# EAGLE design FetherV2_REV1 (EAGLE 9.6.2)
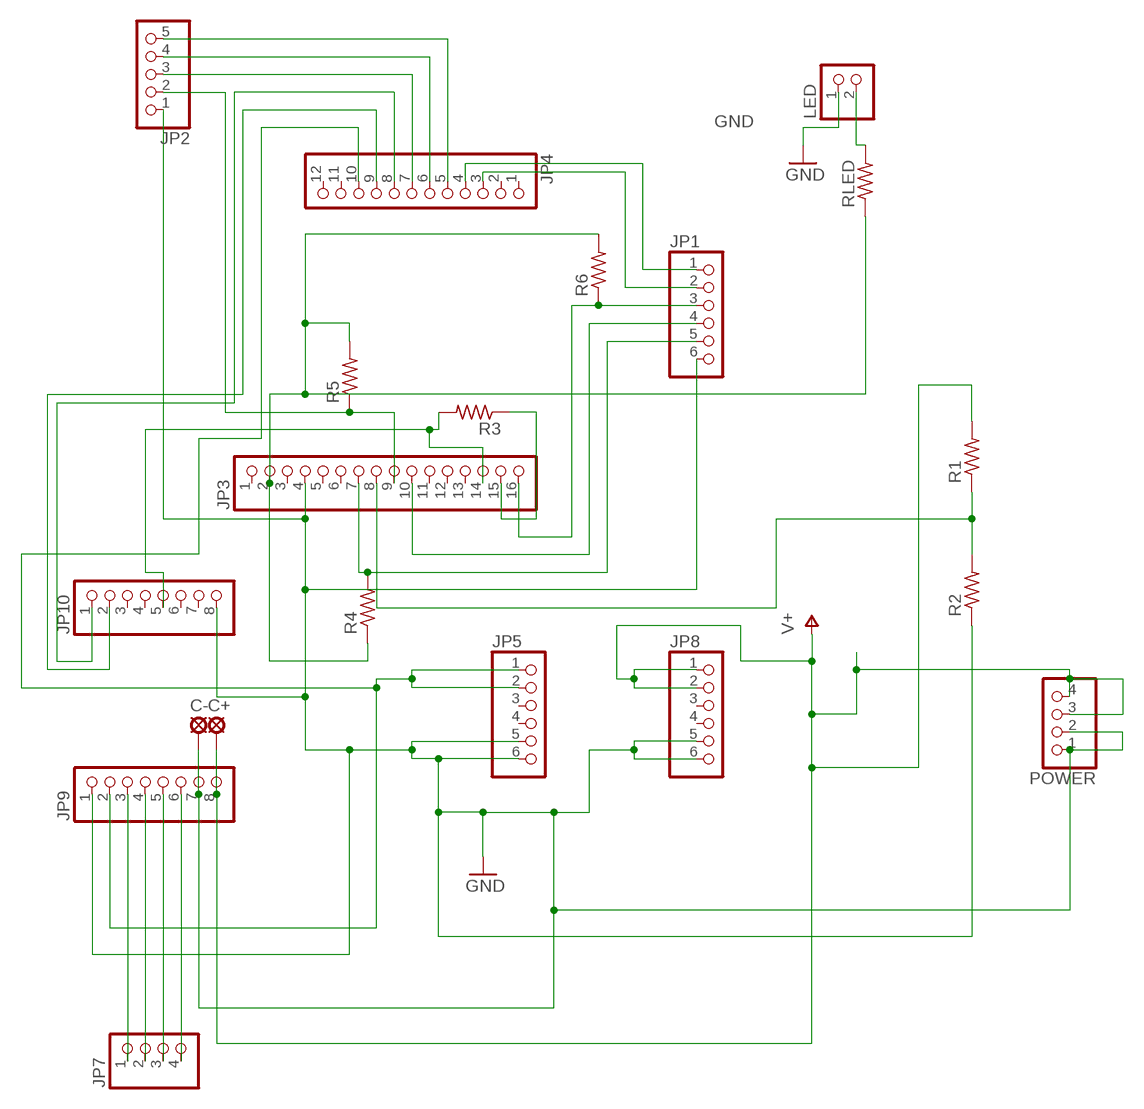
[diagram p0: schematic, sheet 1]

## Parts
C+  SE14  [SE14]
C-  SE14  [SE14]
JP1  PINHD-1X6/90  [1X06/90]
JP2  PINHD-1X5/90  [1X05/90]
JP3  PINHD-1X16  [1X16]
JP4  PINHD-1X12  [1X12]
JP5  PINHD-1X6  [1X06]
JP7  PINHD-1X4  [1X04]
JP8  PINHD-1X6  [1X06]
JP9  PINHD-1X8  [1X08]
JP10  PINHD-1X8  [1X08]
LED  PINHD-1X2  [1X02]
POWER  PINHD-1X4  [1X04]
R1  FLIPFLOP-RES  [0805-THM]
R2  FLIPFLOP-RES  [0805-THM]
R3  FLIPFLOP-RES  [0805-THM]
R4  FLIPFLOP-RES  [0805-THM]
R5  FLIPFLOP-RES  [0805-THM]
R6  FLIPFLOP-RES  [0805-THM]
RLED  FLIPFLOP-RES  [0805-THM]

## Nets
GND: C-.MP JP1.6 JP2.1 JP3.4 JP5.5 JP5.6 JP8.5 JP8.6 JP9.1 JP9.7 JP10.8 LED.1 POWER.1 POWER.2 R2.1
N$1: JP2.2 JP3.9 R5.1
N$2: JP2.3 JP4.7
N$3: JP2.4 JP4.6
N$4: JP2.5 JP4.5
N$5: JP1.1 JP4.4
N$6: JP1.2 JP4.3
N$7: JP7.1 JP9.3
N$8: JP1.3 JP3.16 R6.1
N$9: JP1.4 JP3.10
N$10: JP1.5 JP3.7 R4.2
N$11: LED.2 RLED.2
N$12: JP4.10 JP5.1 JP5.2 JP9.2
N$13: JP7.2 JP9.4
N$14: JP7.3 JP9.5
N$15: JP7.4 JP9.6
N$16: JP3.2 R4.1 R5.2 R6.2 RLED.1
N$17: JP4.8 JP10.1
N$19: JP3.15 R3.1
N$20: JP3.8 R1.1 R2.2
N$21: JP3.14 JP10.5 R3.2
N$22: JP4.9 JP10.2
V+: C+.MP JP8.1 JP8.2 JP9.8 POWER.3 POWER.4 R1.2
Unconnected: JP3.1 JP3.3 JP3.5 JP3.6 JP3.11 JP3.12 JP3.13 JP4.1 JP4.2 JP4.11 JP4.12 JP5.3 JP5.4 JP8.3 JP8.4 JP10.3 JP10.4 JP10.6 JP10.7

## Library data of the parts
C+ C- = solpad:SE14: SOLDER PAD E1553, drill 1,4mm, distributor Buerklin, 07F820
JP1 JP5 JP8 = pinhead:PINHD-1X6: PIN HEADER
JP2 = pinhead:PINHD-1X5: PIN HEADER
JP3 = pinhead:PINHD-1X16: PIN HEADER
JP4 = pinhead:PINHD-1X12: PIN HEADER
JP7 POWER = pinhead:PINHD-1X4: PIN HEADER
JP9 JP10 = pinhead:PINHD-1X8: PIN HEADER
LED = pinhead:PINHD-1X2: PIN HEADER
R1-R6 RLED = adafruit:FLIPFLOP-RES: Flip Flop resistor An 0805 resistor inside a standard 1/4W 5% resistor. Makes for easy mods

## Board
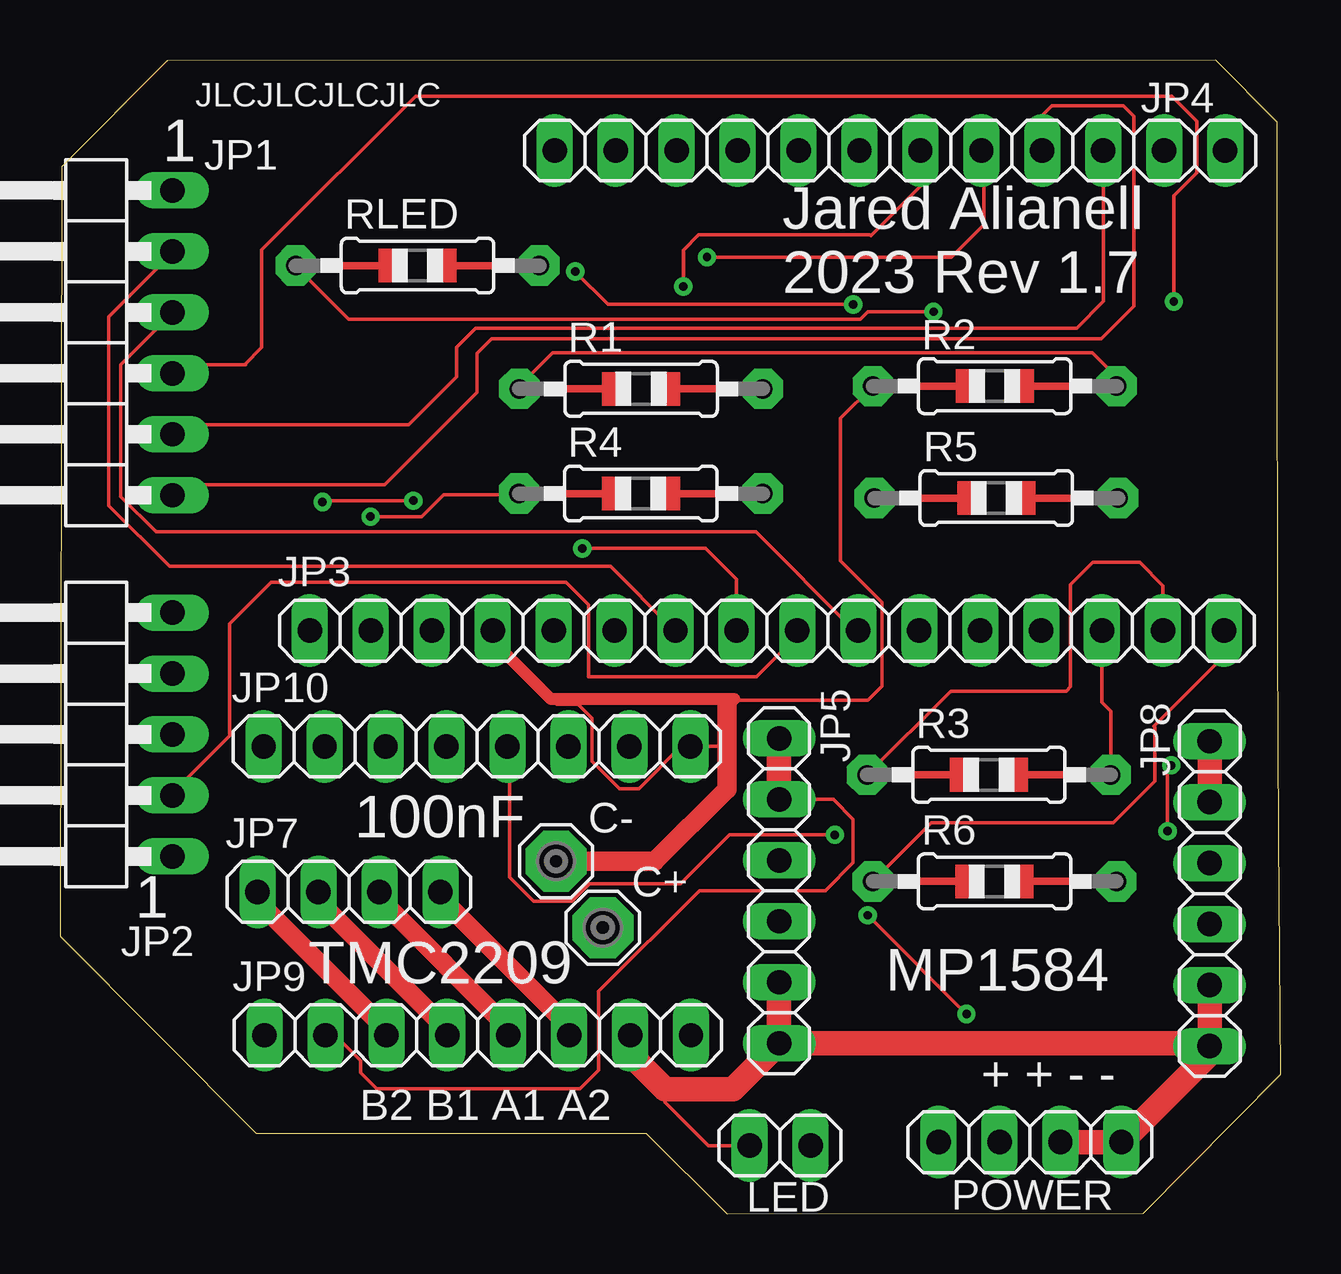
[diagram p1: board, top side]
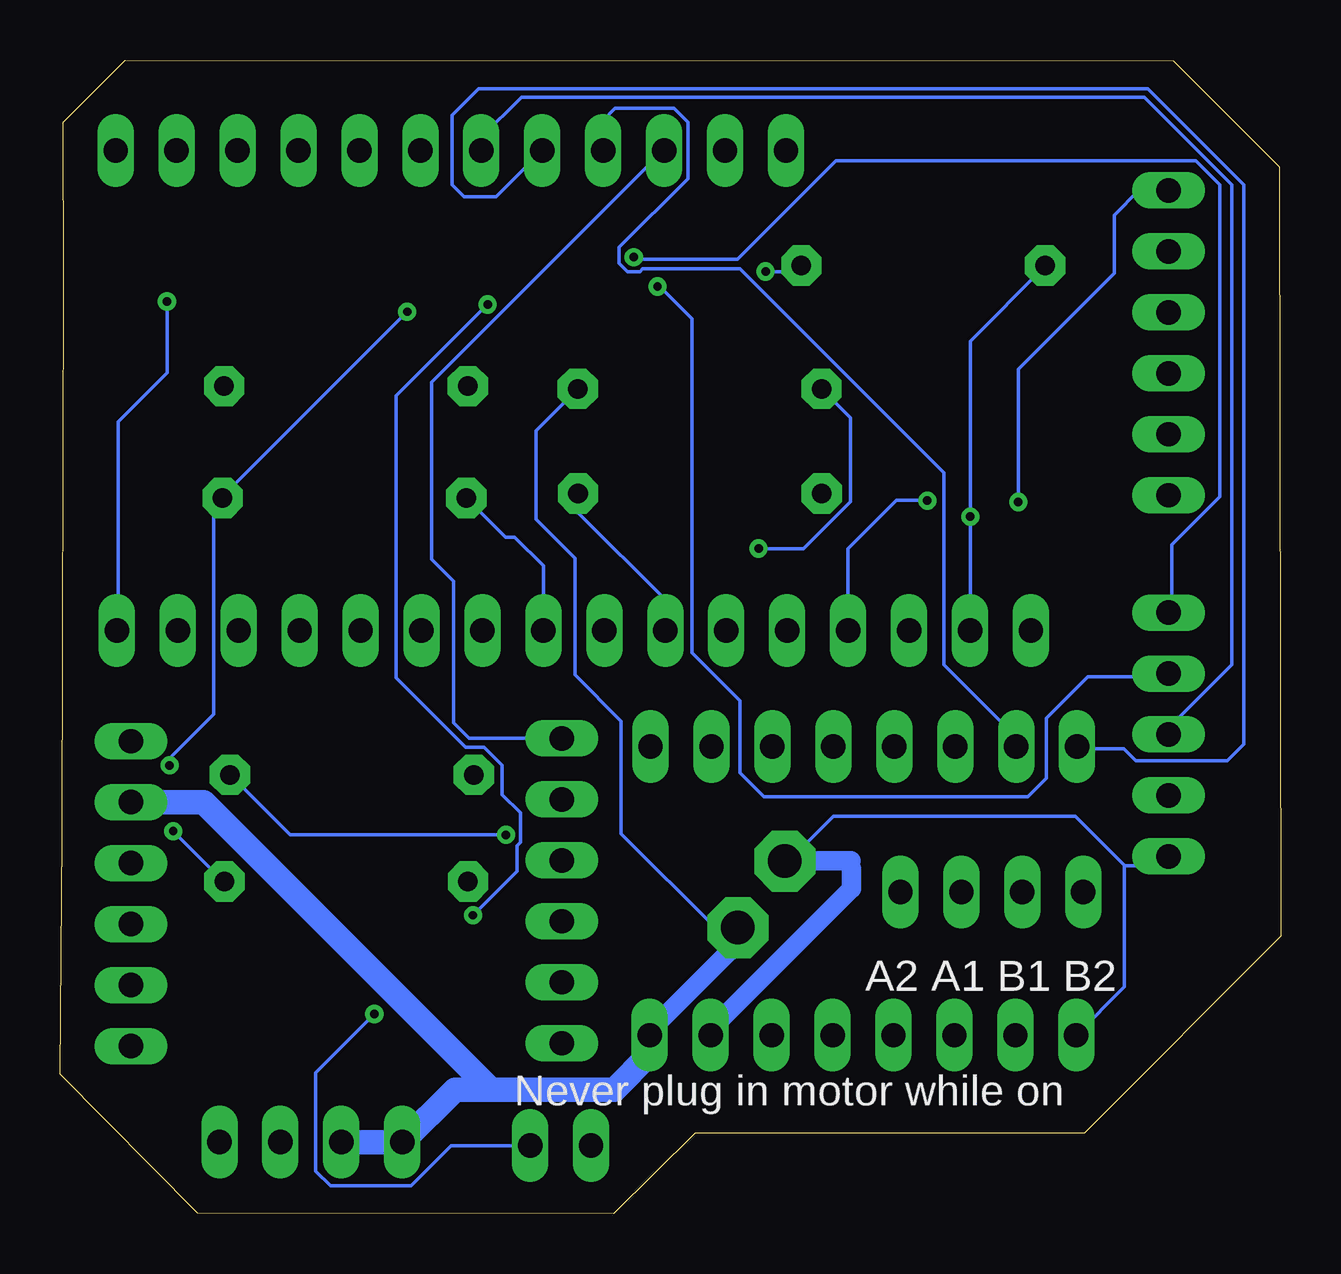
[diagram p2: board, bottom side, seen from below]

Size 50.89 x 48.07 mm. Coordinates in mm from the lower left corner, seen from the top.
Outline: 48.17,48.07 4.47,48.04 0.06,43.62 0,11.56 8.19,3.35 24.43,3.36 27.81,0 45.15,0.01 50.89,5.81 50.8,15.68 50.76,23.8 50.74,38.95 50.75,45.47 48.17,48.07
Copper layers (1*16): Top 0.035mm / dielectric 1.5mm / Bottom 0.035mm
Design rules "default": minimum track width 6mil, minimum drill 0.35mm, track to track 6mil, track to pad 6mil, pad to pad 6mil, via to via 6mil, smd to smd 6mil, copper to edge 40mil, drill to drill 6mil, minimum pad ring 10mil, minimum via ring 8mil, stop-mask expansion 4mil, vias tented up to drill 0mil, thermal gap 10mil

### Footprints (pad centres in the part's own frame; a part is rotated, then mirrored left to right if it is on the bottom)
SE14 = drill 1.397 pad 2.54 octagon: MP 0,0
1X06/90 = drill 1.016 long: 1 -6.35,-3.81; 2 -3.81,-3.81; 3 -1.27,-3.81; 4 1.27,-3.81; 5 3.81,-3.81; 6 6.35,-3.81
1X05/90 = drill 1.016 long: 1 -5.08,-3.81; 2 -2.54,-3.81; 3 0,-3.81; 4 2.54,-3.81; 5 5.08,-3.81
1X16 = drill 1.016 long: 1 -19.05,0; 2 -16.51,0; 3 -13.97,0; 4 -11.43,0; 5 -8.89,0; 6 -6.35,0; 7 -3.81,0; 8 -1.27,0; 9 1.27,0; 10 3.81,0; 11 6.35,0; 12 8.89,0; 13 11.43,0; 14 13.97,0; 15 16.51,0; 16 19.05,0
1X12 = drill 1.016 long: 1 -13.97,0; 2 -11.43,0; 3 -8.89,0; 4 -6.35,0; 5 -3.81,0; 6 -1.27,0; 7 1.27,0; 8 3.81,0; 9 6.35,0; 10 8.89,0; 11 11.43,0; 12 13.97,0
1X06 = drill 1.016 long: 1 -6.35,0; 2 -3.81,0; 3 -1.27,0; 4 1.27,0; 5 3.81,0; 6 6.35,0
1X04 = drill 1.016 long: 1 -3.81,0; 2 -1.27,0; 3 1.27,0; 4 3.81,0
1X08 = drill 1.016 long: 1 -8.89,0; 2 -6.35,0; 3 -3.81,0; 4 -1.27,0; 5 1.27,0; 6 3.81,0; 7 6.35,0; 8 8.89,0
1X02 = drill 1.016 long: 1 -1.27,0; 2 1.27,0
0805-THM = drill 0.813 pad 1.676 octagon: 1 -5.08,0; 2 5.08,0

### Placement (x,y rotation side)
C+  22.63,11.92 0 top
C-  20.68,14.69 0 top
JP1  0.87,36.28 90 top
JP2  0.87,19.97 90 top
JP3  29.47,24.29 0 top
JP4  34.59,44.3 180 top
JP5  29.98,13.45 270 top
JP7  12.04,13.4 0 top
JP8  47.92,13.34 270 top
JP9  17.41,7.44 0 top
JP10  17.38,19.47 0 top
LED  30.02,2.84 0 top
POWER  40.43,2.98 180 top
R1  24.22,34.37 0 top
R2  38.96,34.48 0 top
R3  38.72,18.29 0 top
R4  24.21,30.01 0 top
R5  39.03,29.82 0 top
R6  38.96,13.85 0 top
RLED  14.9,39.51 0 top

### Tracks (layer width: path | path; a pad name or v marks a point on that pad's centre or on a via)
GND  (via drill 0.35)
  Top 0.152: JP3.4 18.04,23.87 20.69,21.22 21.6,21.22 22.18,20.64 22.18,18.85 23.32,17.72 24.14,17.72 25.89,19.47 JP10.8 27.76,19.47 27.79,19.44 | 21.04,14.87 C-.MP | 23.76,7.95 JP9.7 23.76,6.64 | 29.9,9.72 JP5.5 | 47.8,7.1 JP8.6 | JP8.5 | R2.1 32.54,33.13 32.54,32.74 32.54,27.2 34.27,25.47 34.27,21.99 33.67,21.39 28.15,21.39 28.1,21.44 | POWER.2 41.86,2.82 | POWER.1 44.3,3.04 | v14.73,29.71 11.29,29.71 11.24,29.66 v10.94,29.66 | LED.1 27.02,2.84 25.23,4.63 25.23,5.17
  Top 0.508: 18.04,23.87 20.47,21.44 28.1,21.44
  Top 0.813: C-.MP 24.79,14.69 27.79,17.69 27.79,19.44 27.79,21.13
  Top 1.016: JP5.5 JP5.6 | JP8.5 JP8.6 47.92,6.66 44.3,3.04 | 23.76,6.64 25.23,5.17 28.05,5.17 JP5.6 | 47.8,7.1 JP5.6 | POWER.2 POWER.1
  Bottom 0.152: 20.54,14.37 20.63,14.58 | 20.63,14.58 C-.MP | 23.51,7.93 JP9.7 | 17.91,14.7 17.91,14.39 17.9,14.37 | 6.51,14.51 8.56,16.56 18.65,16.56 20.63,14.58 | JP9.1 6.51,9.45 6.51,14.51 | JP1.6 5.91,42.63 6.94,41.61 6.94,39.19 10.94,35.19 v10.94,29.66 | JP3.4 18.04,27.7 16.01,29.73 14.73,29.73 v14.73,29.71 | JP2.1 5.07,14.5 6.5,14.5 6.51,14.51
  Bottom 0.813: 23.51,7.93 17.9,13.54 17.9,14.37 | C-.MP 20.66,14.7 17.91,14.7
N$1
  Top 0.152: JP2.2 5.04,17.87 7.08,19.92 7.08,24.59 8.81,26.32 21.1,26.32 22.04,25.37 22.04,22.37 29.04,22.37 30.54,23.87 JP3.9
  Bottom 0.152: R5.1 32.31,28.18 31.93,28.18 30.74,26.99 JP3.9
N$2
  Bottom 0.152: JP2.3 4.54,20.37 2.04,22.87 2.04,42.87 5.68,46.52 31.65,46.52 33.33,44.84 JP4.7
N$3  (via drill 0.35)
  Top 0.152: v25.98,38.63 25.98,40.15 26.61,40.78 33.76,40.78 33.79,40.74 35.87,42.81 JP4.6
  Bottom 0.152: JP2.4 5.04,22.37 8.04,22.37 9.77,20.65 9.77,18.15 10.54,17.37 21.54,17.37 22.54,18.37 22.54,21.37 24.54,23.37 24.54,37.29 25.87,38.63 v25.98,38.63
N$4  (via drill 0.35)
  Top 0.152: v26.97,39.86 37.15,39.86 38.5,41.21 38.5,44.2 JP4.5
  Bottom 0.152: JP2.5 4.54,25.37 4.54,27.87 2.54,29.87 2.54,42.87 3.54,43.87 18.54,43.87 22.64,39.77 26.89,39.77 v26.97,39.86
N$5
  Top 0.152: JP1.1 5.04,30.37 13.54,30.37 17.39,34.23 17.39,35.85 17.99,36.45 43.41,36.45 44.76,37.81 44.76,45.72 44.32,46.16 41.35,46.16 40.92,45.72 40.92,44.33 JP4.4
N$6
  Top 0.152: JP1.2 5.04,32.87 14.54,32.87 16.53,34.87 16.53,36.1 17.32,36.9 42.38,36.9 43.5,38.01 JP4.3
N$7
  Top 0.152: 13.71,7.55 JP9.3
  Top 0.813: 13.71,7.55 8.24,13.02 JP7.1
N$8  (via drill 0.35)
  Top 0.152: 7.75,35.37 7.7,35.37 | 7.7,35.37 5.04,35.37 JP1.3 | 7.7,35.37 8.42,36.09 8.42,40.16 14.82,46.57 46.35,46.57 47.38,45.53 47.39,45.5 47.39,43.37 46.43,42.41 v46.43,38.01 | R6.1 36.33,16.3 43.91,16.3 45.63,18.02 45.63,20.27 45.6,20.31 48.52,23.22 JP3.16
  Bottom 0.152: v46.43,38.01 | v46.43,38.01 46.43,35.03 48.45,33.01 48.45,24.32 JP3.16
N$9
  Top 0.152: JP1.4 4.54,37.37 2.54,35.37 2.54,29.87 4,28.41 29,28.41 33.04,24.37 JP3.10
N$10
  Top 0.152: JP1.5 4.54,39.87 2.04,37.37 2.04,29.51 4.57,26.97 22.94,26.97 25.54,24.37 JP3.7
  Bottom 0.152: JP3.7 25.66,25.58 29.29,29.21 R4.2
N$11  (via drill 0.35)
  Top 0.152: v33.67,12.43 v37.78,8.32 | v33.06,37.88 22.85,37.88 v21.48,39.26
  Bottom 0.152: v37.78,8.32 40.22,5.88 40.22,1.77 39.61,1.16 36.26,1.16 34.58,2.83 31.38,2.83 LED.2 | v33.67,12.43 31.84,14.26 31.84,15.33 31.69,15.48 31.69,16.7 32.45,17.46 32.45,18.68 33.21,19.44 33.97,19.44 36.87,22.34 36.87,34.07 v33.06,37.88 | v21.48,39.26 20.26,39.26 20.11,39.41 RLED.2
N$12
  Top 0.152: JP9.2 11.54,7.37 12.54,6.37 12.54,5.87 13.21,5.2 21.68,5.2 22.45,5.98 22.45,9.26 26.65,13.46 31.9,13.46 33.06,14.62 33.06,16.44 32.24,17.26 JP5.2
  Top 1.016: JP5.2 JP5.1
  Bottom 0.152: JP5.1 33.84,19.8 34.48,20.45 34.48,26.35 35.41,27.28 35.41,34.64 25.74,44.3 JP4.10
N$13
  Top 0.152: 16.25,7.55 JP9.4
  Top 0.813: 16.25,7.55 10.78,13.02 JP7.2
N$14
  Top 0.152: 18.82,7.61 JP9.5
  Top 0.813: 18.82,7.61 13.32,13.12 JP7.3
N$15
  Top 0.152: 21.38,7.65 JP9.6
  Top 0.813: 21.38,7.65 15.86,13.17 JP7.4
N$16  (via drill 0.35)
  Top 0.152: v46.17,15.94 46.17,18.53 v46.32,18.68 | v12.94,29.05 15.08,29.05 15.99,29.96 19.04,29.96 R4.1 | v36.41,37.58 33.67,37.58 33.36,37.27 12.03,37.27 9.9,39.41 RLED.1
  Bottom 0.152: v46.17,15.94 44.19,13.96 R6.2 | v46.32,18.68 46.32,18.99 44.49,20.82 44.49,29.5 44.19,29.81 R5.2 44.03,29.96 v36.41,37.58 | JP3.2 12.94,24.32 v12.94,29.05 12.94,36.36 9.9,39.41 RLED.1
N$17
  Bottom 0.152: JP10.1 8.04,19.37 6.54,19.37 6.04,18.87 2.22,18.87 1.54,19.56 1.54,42.87 5.54,46.87 33.44,46.87 34.54,45.77 34.54,42.87 34.04,42.37 32.71,42.37 JP4.8
N$19
  Top 0.152: R3.1 37.13,21.78 41.94,21.78 42.11,21.95 42.11,26.2 43.05,27.14 45.01,27.14 45.98,26.17 JP3.15
N$20  (via drill 0.35)
  Top 0.152: R1.1 19.04,34.37 20.54,35.87 43.04,35.87 44.04,34.87 R2.2 | JP3.8 28.2,26.43 26.9,27.72 21.78,27.72 v21.77,27.71
  Bottom 0.152: v21.77,27.71 19.89,27.71 17.95,29.66 17.95,33.17 R1.1
N$21  (via drill 0.35)
  Top 0.152: JP3.14 43.44,21.3 43.8,20.94 R3.2 | v32.3,15.79 27.91,15.79 25.86,13.74 22.07,13.74 21.35,13.02 19.73,13.02 18.73,14.02 18.73,19.44 JP10.5
  Bottom 0.152: v32.3,15.79 41.29,15.79 43.73,18.22 R3.2
N$22
  Bottom 0.152: JP10.2 11.04,19.87 14.04,22.87 14.04,30.87 22.54,39.37 26.59,39.37 26.72,39.25 27.22,39.25 27.58,39.61 27.58,40.26 24.71,43.13 24.71,45.47 25.29,46.05 27.74,46.05 28.25,45.55 JP4.9
V+
  Top 0.152: 47.95,17.12 JP8.2 | JP8.2 47.92,17.12 | 47.34,17.15 JP8.2 | R1.2 29.3,34.34
  Top 1.016: JP8.1 JP8.2
  Bottom 0.152: 26.04,7.87 JP9.8 | 23.01,10.9 C+.MP 23.57,11.92 27.5,15.84 27.5,20.52 29.42,22.45 29.42,27.32 31.04,28.94 31.04,32.63 R1.2
  Bottom 0.813: 23.01,10.9 26.04,7.87 | JP9.8 26.3,6.65
  Bottom 1.016: 26.3,6.65 27.78,5.17 32.93,5.17 | JP8.2 44.9,17.15 32.93,5.17 | 32.93,5.17 34.43,5.17 POWER.4 POWER.3

### Text on the board
tNames: JLCJLCJLCJLC | 1 | Jared Alianell / 2023 Rev 1.7 | 100nF | 1 | TMC2209 | MP1584 | + + - - | B2 B1 A1 A2
bNames: A2 A1 B1 B2 | Never plug in motor while on